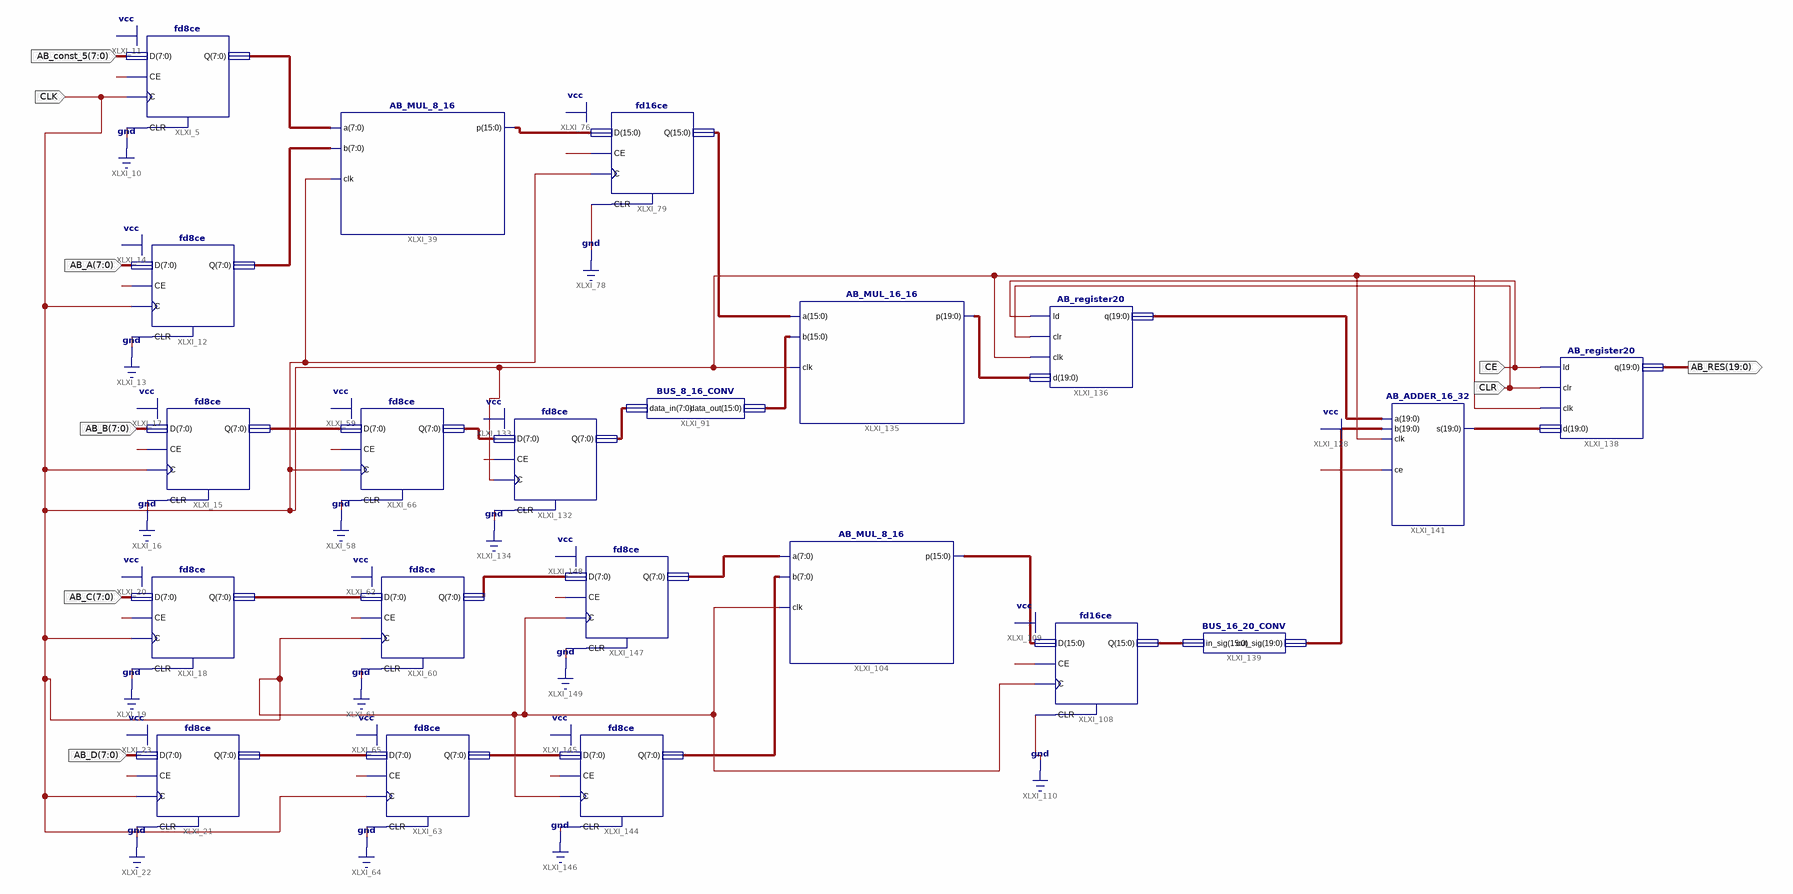
[diagram p0: schematic sheet 1]
// Xilinx ISE schematic AB_conv_scheme.sch (virtex7) as structural Verilog: 21 symbols, 9 ports
module AB_conv_scheme (
  input  [7:0] AB_const_5,
  input  [7:0] AB_A,
  input  [7:0] AB_B,
  input  [7:0] AB_C,
  input  [7:0] AB_D,
  input  CE,
  input  CLR,
  input  CLK,
  output [19:0] AB_RES
);

  wire [7:0] B_stage1, C_stage1, C_stage2, D_stage1, D_stage2, MUL1_A, MUL1_B, MUL3_A, MUL3_B, XLXN_212,
       XLXN_213;
  wire [15:0] MUL1_OUT, MUL2_A, MUL2_B, MUL3_OUT, XLXN_207;
  wire [19:0] ADD_A, ADD_B, ADD_OUT, MUL2_OUT;

  fd8ce XLXI_5 (.C(CLK), .CE(1'b1), .CLR(1'b0), .D(AB_const_5), .Q(MUL1_A));
  fd8ce XLXI_12 (.C(CLK), .CE(1'b1), .CLR(1'b0), .D(AB_A), .Q(MUL1_B));
  AB_MUL_8_16 XLXI_39 (.a(MUL1_A), .b(MUL1_B), .clk(CLK), .p(MUL1_OUT));
  fd8ce XLXI_15 (.C(CLK), .CE(1'b1), .CLR(1'b0), .D(AB_B), .Q(B_stage1));
  fd8ce XLXI_18 (.C(CLK), .CE(1'b1), .CLR(1'b0), .D(AB_C), .Q(C_stage1));
  fd8ce XLXI_21 (.C(CLK), .CE(1'b1), .CLR(1'b0), .D(AB_D), .Q(D_stage1));
  fd16ce XLXI_79 (.C(CLK), .CE(1'b1), .CLR(1'b0), .D(MUL1_OUT), .Q(MUL2_A));
  fd8ce XLXI_60 (.C(CLK), .CE(1'b1), .CLR(1'b0), .D(C_stage1), .Q(C_stage2));
  fd8ce XLXI_63 (.C(CLK), .CE(1'b1), .CLR(1'b0), .D(D_stage1), .Q(D_stage2));
  fd8ce XLXI_66 (.C(CLK), .CE(1'b1), .CLR(1'b0), .D(B_stage1), .Q(XLXN_212));
  BUS_8_16_CONV XLXI_91 (.data_in(XLXN_213), .data_out(MUL2_B));
  AB_MUL_8_16 XLXI_104 (.a(MUL3_A), .b(MUL3_B), .clk(CLK), .p(MUL3_OUT));
  fd16ce XLXI_108 (.C(CLK), .CE(1'b1), .CLR(1'b0), .D(MUL3_OUT), .Q(XLXN_207));
  AB_MUL_16_16 XLXI_135 (.a(MUL2_A), .b(MUL2_B), .clk(CLK), .p(MUL2_OUT));
  AB_register20 XLXI_136 (.ld(CE), .clr(CLR), .clk(CLK), .d(MUL2_OUT), .q(ADD_A));
  AB_register20 XLXI_138 (.ld(CE), .clr(CLR), .clk(CLK), .d(ADD_OUT), .q(AB_RES));
  BUS_16_20_CONV XLXI_139 (.in_sig(XLXN_207), .out_sig(ADD_B));
  AB_ADDER_16_32 XLXI_141 (.a(ADD_A), .b(ADD_B), .clk(CLK), .ce(1'b1), .s(ADD_OUT));
  fd8ce XLXI_132 (.C(CLK), .CE(1'b1), .CLR(1'b0), .D(XLXN_212), .Q(XLXN_213));
  fd8ce XLXI_147 (.C(CLK), .CE(1'b1), .CLR(1'b0), .D(C_stage2), .Q(MUL3_A));
  fd8ce XLXI_144 (.C(CLK), .CE(1'b1), .CLR(1'b0), .D(D_stage2), .Q(MUL3_B));
endmodule
